# Altium project Accumulator_DC-DC.PrjPCB
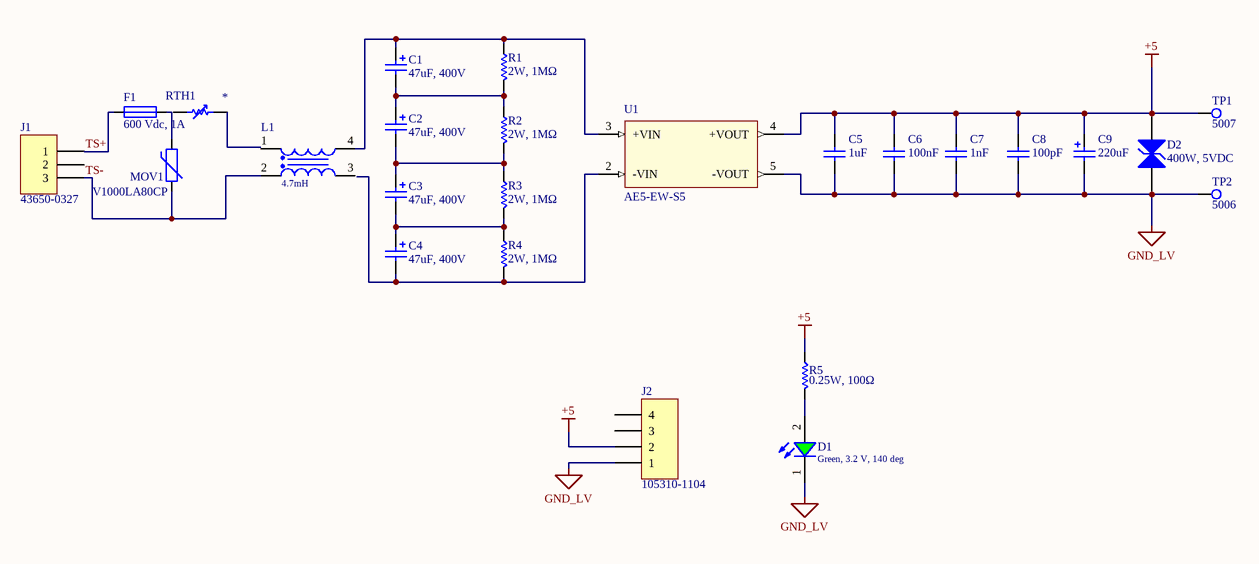
[diagram p0: Accumulator_DC-DC.SchDoc]
1 sheet, 25 parts. Net scope: global (net labels, ports and power ports of the same name join across sheets).
Board file: Accumulator_DC-DC.PcbDoc

## Sheet Accumulator_DC-DC.SchDoc: Accumulator DC-DC
size A4; DrawnBy: Àlex Sánchez i Benet; DocumentNumber: 1; Revision: 1; SheetNumber: 1; SheetTotal: 1; University: UPC EEBE; City: Barcelona; Country: Spain; CP: 08019; DesignerName: Àlex Sánchez i Benet; Address: Av. Eduard Maristany, 16

### Parts
C1  47uF, 400V  [WCAP-ATG5_D16H25]
C2  47uF, 400V  [WCAP-ATG5_D16H25]
C3  47uF, 400V  [WCAP-ATG5_D16H25]
C4  47uF, 400V  [WCAP-ATG5_D16H25]
C5  1uF  [1206_3.2x1.6x1.15mm]
C6  100nF  [1206_3.2x1.6x0.8mm]
C7  1nF  [1206_3.2x1.6x0.8mm]
C8  100pF  [1206_3.2x1.6x0.8mm]
C9  220uF  [WCAP-ATG8_6.3x11x2.5]
D1  Green, 3.2 V, 140 deg  [WL-SMCW_1206]
D2  400W, 5VDC  [WE-TVSP_DO-214AC_Bidirectional]
F1  600 Vdc, 1A  [485001]
J1  43650-0327  [43650-0327]
J2  105310-1104  [105310-1104]
L1  4.7mH  [WE-CMB HV_Type XXL_744831047068]
MOV1  V1000LA80CP  [V1000LA160CP]
R1  2W, 1MΩ  [CR2512]
R2  2W, 1MΩ  [CR2512]
R3  2W, 1MΩ  [CR2512]
R4  2W, 1MΩ  [CR2512]
R5  0.25W, 100Ω  [CR1206]
RTH1  Inrush_Current_Limiter  [Inrush_Current_Limiter]  (value not drawn)
TP1  5007  [5007]
TP2  5006  [5006]
U1  AE5-EW-S5  [AE5-EW-S5]

### Nets
+5: C5.2 C6.2 C7.2 C8.2 C9.1(P) D2.2(C) J2.2 R5.2 TP1.0 U1.4(+VOUT)
GND_LV: C5.1 C6.1 C7.1 C8.1 C9.2(N) D1.1(K) D2.1(C) J2.1 TP2.0 U1.5(-VOUT)
TS+: F1.1 J1.1
NetC1_1: C1.1(P) L1.4 R1.2 U1.3(+VIN)
NetC1_2: C1.2(N) C2.1(P) R1.1 R2.2
NetC2_2: C2.2(N) C3.1(P) R2.1 R3.2
NetC3_2: C3.2(N) C4.1(P) R3.1 R4.2
NetC4_2: C4.2(N) R4.1 U1.2(-VIN)
NetD1_2: D1.2(A) R5.1
NetF1_2: F1.2 MOV1.2
NetJ1_3: J1.3 L1.2 MOV1.1

Not connected (* = marked no-connect by the designer): J1 2; J2 3 4; L1 1 3; RTH1 1 2

### Notes on the sheet
- Title
- e-Tech Racing
- UPC EEBE
- Size:
- Date:
- Drawn by:
- A4
- Number:
- Time:
- Revision:
- Sheet
- of
- Av. Eduard Maristany, 16
- 08019
- Barcelona Spain
- Made with:
- Checked by:

### Notes on the sheet
- Labels drawn without touching a wire or pin: TS-

### Library data of the parts
C1-C4 = 860021380015: WCAP-ATG5 Aluminum Electrolytic Capacitor, Radial, THT, D16xH25, 47uF, 400V; Manufacturer: Wurth Elektronik; Endurance: 2000h; Ripple Current: 300mA; Technical Reference: ATJK250470M400DSPAEB000; Dissipation Factor: 15%; Capacitance Tolerance: +/-20%; Leakage Current: 564uA; Rated Voltage: 400VDC; Height: 25mm; ComponentLink1URL: http://www.we-online.de; ComponentLink2URL: https://www.we-online.com/catalog/datasheet/860021380015.pdf; ComponentLink2Description: Datasheet; Diameter: 16mm; Mounting Technology: THT; Capacitance: 47uF; Manufacturer Part Number: 860021380015; Packaging: Ammo Pack; Published Date: October 2020; ComponentLink1Description: Manufacturer; Operating Temperature: -25 to +105degC
C5 = 885012208013: WCAP-CSGP Ceramic Capacitors, 1206, X7R, 10V, 1uF; Manufacturer: Wurth Elektronik; Rated Voltage: 10V DC; ComponentLink1Description: Manufacturer; ComponentLink1URL: http://www.we-online.de; ComponentLink2Description: Datasheet; ComponentLink2URL: http://katalog.we-online.de/pbs/datasheet/885012208013.pdf; Part Number: 885012208013; Size: 1206; Operating Temperature: -55 °C to +125 °C; Value: 1uF; Ceramic Type: X7R
C6 = 885012208009: WCAP-CSGP Ceramic Capacitors, 1206, X7R, 10V, 100nF; Manufacturer: Wurth Elektronik; Rated Voltage: 10V DC; ComponentLink1Description: Manufacturer; ComponentLink1URL: http://www.we-online.de; ComponentLink2Description: Datasheet; ComponentLink2URL: http://katalog.we-online.de/pbs/datasheet/885012208009.pdf; Part Number: 885012208009; Size: 1206; Operating Temperature: -55 °C to +125 °C; Ceramic Type: X7R; Value: 100nF
C7 = 885012208006: WCAP-CSGP Ceramic Capacitors, 1206, X7R, 10V, 1nF; Manufacturer: Wurth Elektronik; Rated Voltage: 10V DC; ComponentLink1Description: Manufacturer; ComponentLink1URL: http://www.we-online.de; ComponentLink2Description: Datasheet; ComponentLink2URL: http://katalog.we-online.de/pbs/datasheet/885012208006.pdf; Part Number: 885012208006; Size: 1206; Operating Temperature: -55 °C to +125 °C; Value: 1nF; Ceramic Type: X7R
C8 = 885012008004: WCAP-CSGP Ceramic Capacitors, 1206, NP0, 10V, 100pF; Manufacturer: Wurth Elektronik; Rated Voltage: 10V DC; ComponentLink1Description: Manufacturer; ComponentLink1URL: http://www.we-online.de; ComponentLink2Description: Datasheet; ComponentLink2URL: http://katalog.we-online.de/pbs/datasheet/885012008004.pdf; Part Number: 885012008004; Size: 1206; Operating Temperature: -55 °C to +125 °C; Value: 100pF; Ceramic Type: NP0
C9 = 860010273009: WCAP-ATG8 Aluminum Electrolytic Capacitors, 6.3x11mm, 10 Vdc, 220 uF; Manufacturer: Wurth Elektronik; Rated Voltage: 10 Vdc; ComponentLink1Description: Manufacturer; ComponentLink1URL: http://www.we-online.de; ComponentLink2Description: Datasheet; ComponentLink2URL: http://katalog.we-online.de/pbs/datasheet/860010273009.pdf; Part Number: 860010273009; Size: 6.3x11mm; Life Cycle: 2000h; Operating Temperature: -40 °C up to +85 °C; Value: 220 uF
D1 = 150120GS75000: SMT Mono-color Chip LED Waterclear WL-SMCW, size 1206, Green, 3.2 V, 140 deg, 450 mcd; Forward Voltage: 3.2 V; Viewing Angle: 140 deg; Peak Wavelength: 515 nm; Dominant Wavelength: 525 nm; Luminous Intensity: 450 mcd; Chip Technology: InGaN; ComponentLink1Description: Manufacturer; ComponentLink1URL: http://www.we-online.de; ComponentLink2Description: Datasheet; ComponentLink2URL: https://katalog.we-online.de/led/datasheet/150120GS75000.pdf; Part Number: 150120GS75000; Published Date: November 2018; Publisher: Wurth Elektronik; Size: 1206; Operating Temperature: -40 to 85 degC; Emitting Color: Green; Mounting Technology: SMT; Packaging: Tape and Reel
D2 = 824501500: WE-TVSP Power TVS Diode, size DO-214AC, Bidirectional, 400 W, 5 VDC; Manufacturer: Wurth Elektronik; Peak Pulse Current: 43.5 A; Reverse Breakdown Voltage: 6.7 V; Reverse Stand-Off Voltage: 5 V; Surge Clamping Voltage: 9.2 V; ComponentLink1Description: Manufacturer; ComponentLink1URL: http://www.we-online.de; ComponentLink2Description: Datasheet; ComponentLink2URL: https://katalog.we-online.de/pbs/datasheet/824501500.pdf; Part Number: 824501500; Size: DO-214AC; Operating Temperature: -65ºC to 150 ºC; Mounting Technology: SMT; Packaging: Tape and Reel; Polarity: Bidirectional; Power Dissipation: 400 W
F1 = 485001: 485 Series Fuse; Manufacturer: Littlefuse; ComponentLink1Description: Datasheet; ComponentLink1URL: https://www.littelfuse.com/~/media/electronics/datasheets/fuses/littelfuse_fuse_485_datasheet.pdf.pdf
J1 = 43650-0327: Micro-Fit 3.0 Vertical Header, 3.00mm Pitch, Single Row, 3 Circuits, Black; Manufacturer: Molex; Rated Voltage: 600V DC; Rated Current: 8.5A; Number of Row: 1; Circuits: 3; Operating Temperature: -40° to +105°C; ComponentLink1Description: Datasheet; ComponentLink1URL: https://www.molex.com/webdocs/datasheets/pdf/en-us/0436500327_PCB_HEADERS.pdf
J2 = 105310-1104: Nano-Fit Vertical Header, Through Hole, 2.50mm Pitch, Dual Row, 4 Circuits, Black; Manufacturer: Molex; Rated Voltage: 250V DC; Rated Current: 6.5A; Operating Temperature: -40° to +105°C; ComponentLink2Description: Datasheet; ComponentLink2URL: https://www.molex.com/webdocs/datasheets/pdf/en-us/1053101104_PCB_HEADERS.pdf
L1 = 744831047068: WE-CMB HV Common Mode Power Line Choke, Type XXL, 4.7mH, 6.8A, 760V; Manufacturer: Wurth Elektronik; DC Resistance max.: 44mOhm; Insulation Test Voltage: 3000VAC; Rated Voltage: 760VAC; ComponentLink1Description: Manufacturer; ComponentLink1URL: http://www.we-online.de; ComponentLink2Description: Datasheet; ComponentLink2URL: https://www.we-online.com/catalog/datasheet/744831047068.pdf; Manufacturer Part Number: 744831047068; Published Date: April 2020; Operating Temperature: -40 to +125degC; Mounting Technology: THT; Packaging: Tray and Carton; Inductance: 4.7mH; Rated Current: 6.8A; Size: Type XXL
MOV1 = V1000LA80CP: C-III Varistor Series; Manufacturer: Littlefuse; ComponentLink1Description: Datasheet; ComponentLink1URL: https://www.littelfuse.com/~/media/electronics/datasheets/varistors/littelfuse_varistor_ciii_datasheet.pdf.pdf
R1-R4 = CRS2512-FX-1004ELF: High Power Anti-Surge Chip Resistor; Manufacturer: Bourns; ComponentLink1Description: Datasheet; ComponentLink1URL: https://www.bourns.com/docs/product-datasheets/crs.pdf?sfvrsn=2852b1ed_29
R5 = CR1206-FX-1000ELF: Chip Resistor; Manufacturer: Bourns; ComponentLink1Description: Datasheet; ComponentLink1URL: https://www.bourns.com/docs/product-datasheets/chpreztr.pdf?sfvrsn=566c91f1_11
RTH1 = Inrush_Current_Limiter: THT NTC Inrush Current Limiter; Time constant: *
TP1 = 5007: Compact THM Test Point, White; Manufacturer: Keystone Electronics; ComponentLink1Description: Datasheet (Mouser); ComponentLink1URL: https://eu.mouser.com/datasheet/2/215/005-5009-741293.pdf
TP2 = 5006: Compact THM Test Point, Black; Manufacturer: Keystone Electronics; ComponentLink1Description: Datasheet (Mouser); ComponentLink1URL: https://eu.mouser.com/datasheet/2/215/005-5009-741293.pdf; Color: Black
U1 = AE5-EW-S5: Ultra Wide Voltage Input DC-DC Converter; Manufacturer: CUI INC; Datasheet: https://www.cui.com/product/resource/ae5-ew.pdf; ComponentLink1Description: Datasheet; ComponentLink1URL: https://www.cui.com/product/resource/ae5-ew.pdf